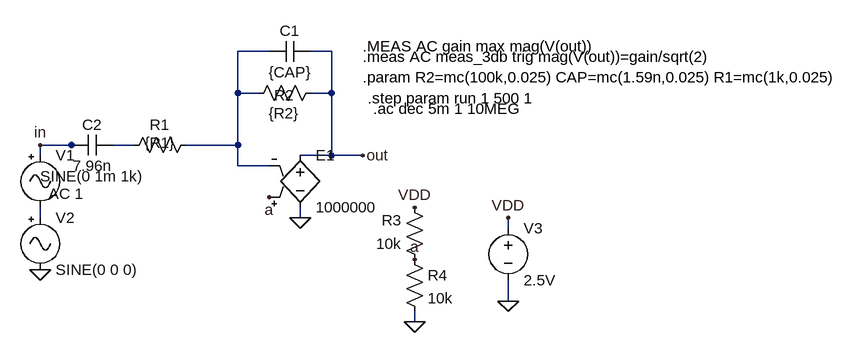
[diagram p0: schematic passabaixa-corte1k-comacoplamento.asc]
passabaixa-corte1k-comacoplamento.asc, the LTspice schematic file:
Version 4
SHEET 1 1224 680
WIRE 144 48 96 48
WIRE 240 48 208 48
WIRE 96 112 96 48
WIRE 128 112 96 112
WIRE 240 112 240 48
WIRE 240 112 208 112
WIRE -160 192 -208 192
WIRE -144 192 -160 192
WIRE -64 192 -96 192
WIRE 96 192 96 112
WIRE 96 192 16 192
WIRE -208 208 -208 192
WIRE 240 208 240 112
WIRE 240 208 192 208
WIRE 288 208 240 208
WIRE 96 224 96 192
WIRE 144 224 96 224
WIRE -208 304 -208 288
WIRE 192 304 192 288
WIRE 512 320 512 304
WIRE 512 432 512 400
WIRE 368 464 368 448
FLAG -208 192 in
FLAG 288 208 out
FLAG 192 304 0
FLAG -208 384 0
FLAG 368 464 0
FLAG 144 272 a
FLAG 368 368 a
FLAG 512 432 0
FLAG 512 304 VDD
FLAG 368 288 VDD
SYMBOL res 224 96 R90
WINDOW 0 35 57 VBottom 2
WINDOW 3 63 57 VBottom 2
SYMATTR InstName R2
SYMATTR Value {R2}
SYMBOL cap 208 32 R90
WINDOW 0 0 32 VBottom 2
WINDOW 3 32 32 VTop 2
SYMATTR InstName C1
SYMATTR Value {CAP}
SYMBOL res 32 176 R90
WINDOW 0 0 56 VBottom 2
WINDOW 3 28 56 VBottom 2
SYMATTR InstName R1
SYMATTR Value {R1}
SYMBOL e2 192 192 R0
SYMATTR InstName E1
SYMATTR Value 1000000
SYMBOL Misc\\signal -208 192 R0
WINDOW 3 0 48 Left 2
WINDOW 123 13 75 Left 2
WINDOW 39 0 0 Left 2
SYMATTR Value SINE(0 1m 1k)
SYMATTR Value2 AC 1
SYMATTR InstName V1
SYMBOL Misc\\signal -208 288 R0
WINDOW 123 0 0 Left 2
WINDOW 39 0 0 Left 2
SYMATTR InstName V2
SYMATTR Value SINE(0 0 0)
SYMBOL res 384 384 R180
WINDOW 0 36 76 Left 2
WINDOW 3 36 40 Left 2
SYMATTR InstName R3
SYMATTR Value 10k
SYMBOL res 352 352 R0
SYMATTR InstName R4
SYMATTR Value 10k
SYMBOL voltage 512 304 R0
WINDOW 123 0 0 Left 2
WINDOW 39 0 0 Left 2
SYMATTR InstName V3
SYMATTR Value 2.5V
SYMBOL cap -96 176 R90
WINDOW 0 0 32 VBottom 2
WINDOW 3 32 32 VTop 2
SYMATTR InstName C2
SYMATTR Value 7.96n
TEXT 288 40 Left 2 !.MEAS AC gain max mag(V(out))
TEXT 288 56 Left 2 !.meas AC meas_3db trig mag(V(out))=gain/sqrt(2)
TEXT 288 88 Left 2 !.param R2=mc(100k,0.025) CAP=mc(1.59n,0.025) R1=mc(1k,0.025)
TEXT 296 120 Left 2 !.step param run 1 500 1
TEXT 304 136 Left 2 !.ac dec 5m 1 10MEG

The netlist it stands for:
* passabaixa-corte1k-comacoplamento.asc
R2 out N001 {R2}
C1 out N001 {CAP}
R1 N001 N002 {R1}
E1 out 0 a N001 1000000
V1 in N003 SINE(0 1m 1k) AC 1
V2 N003 0 SINE(0 0 0)
R3 a VDD 10k
R4 a 0 10k
V3 VDD 0 2.5V
C2 N002 in 7.96n
.MEAS AC gain max mag(V(out))
.meas AC meas_3db trig mag(V(out))=gain/sqrt(2)
.param R2=mc(100k,0.025) CAP=mc(1.59n,0.025) R1=mc(1k,0.025)
.step param run 1 500 1
.ac dec 5m 1 10MEG
.backanno
.end